# EAGLE design LAMPS (EAGLE 6.3)
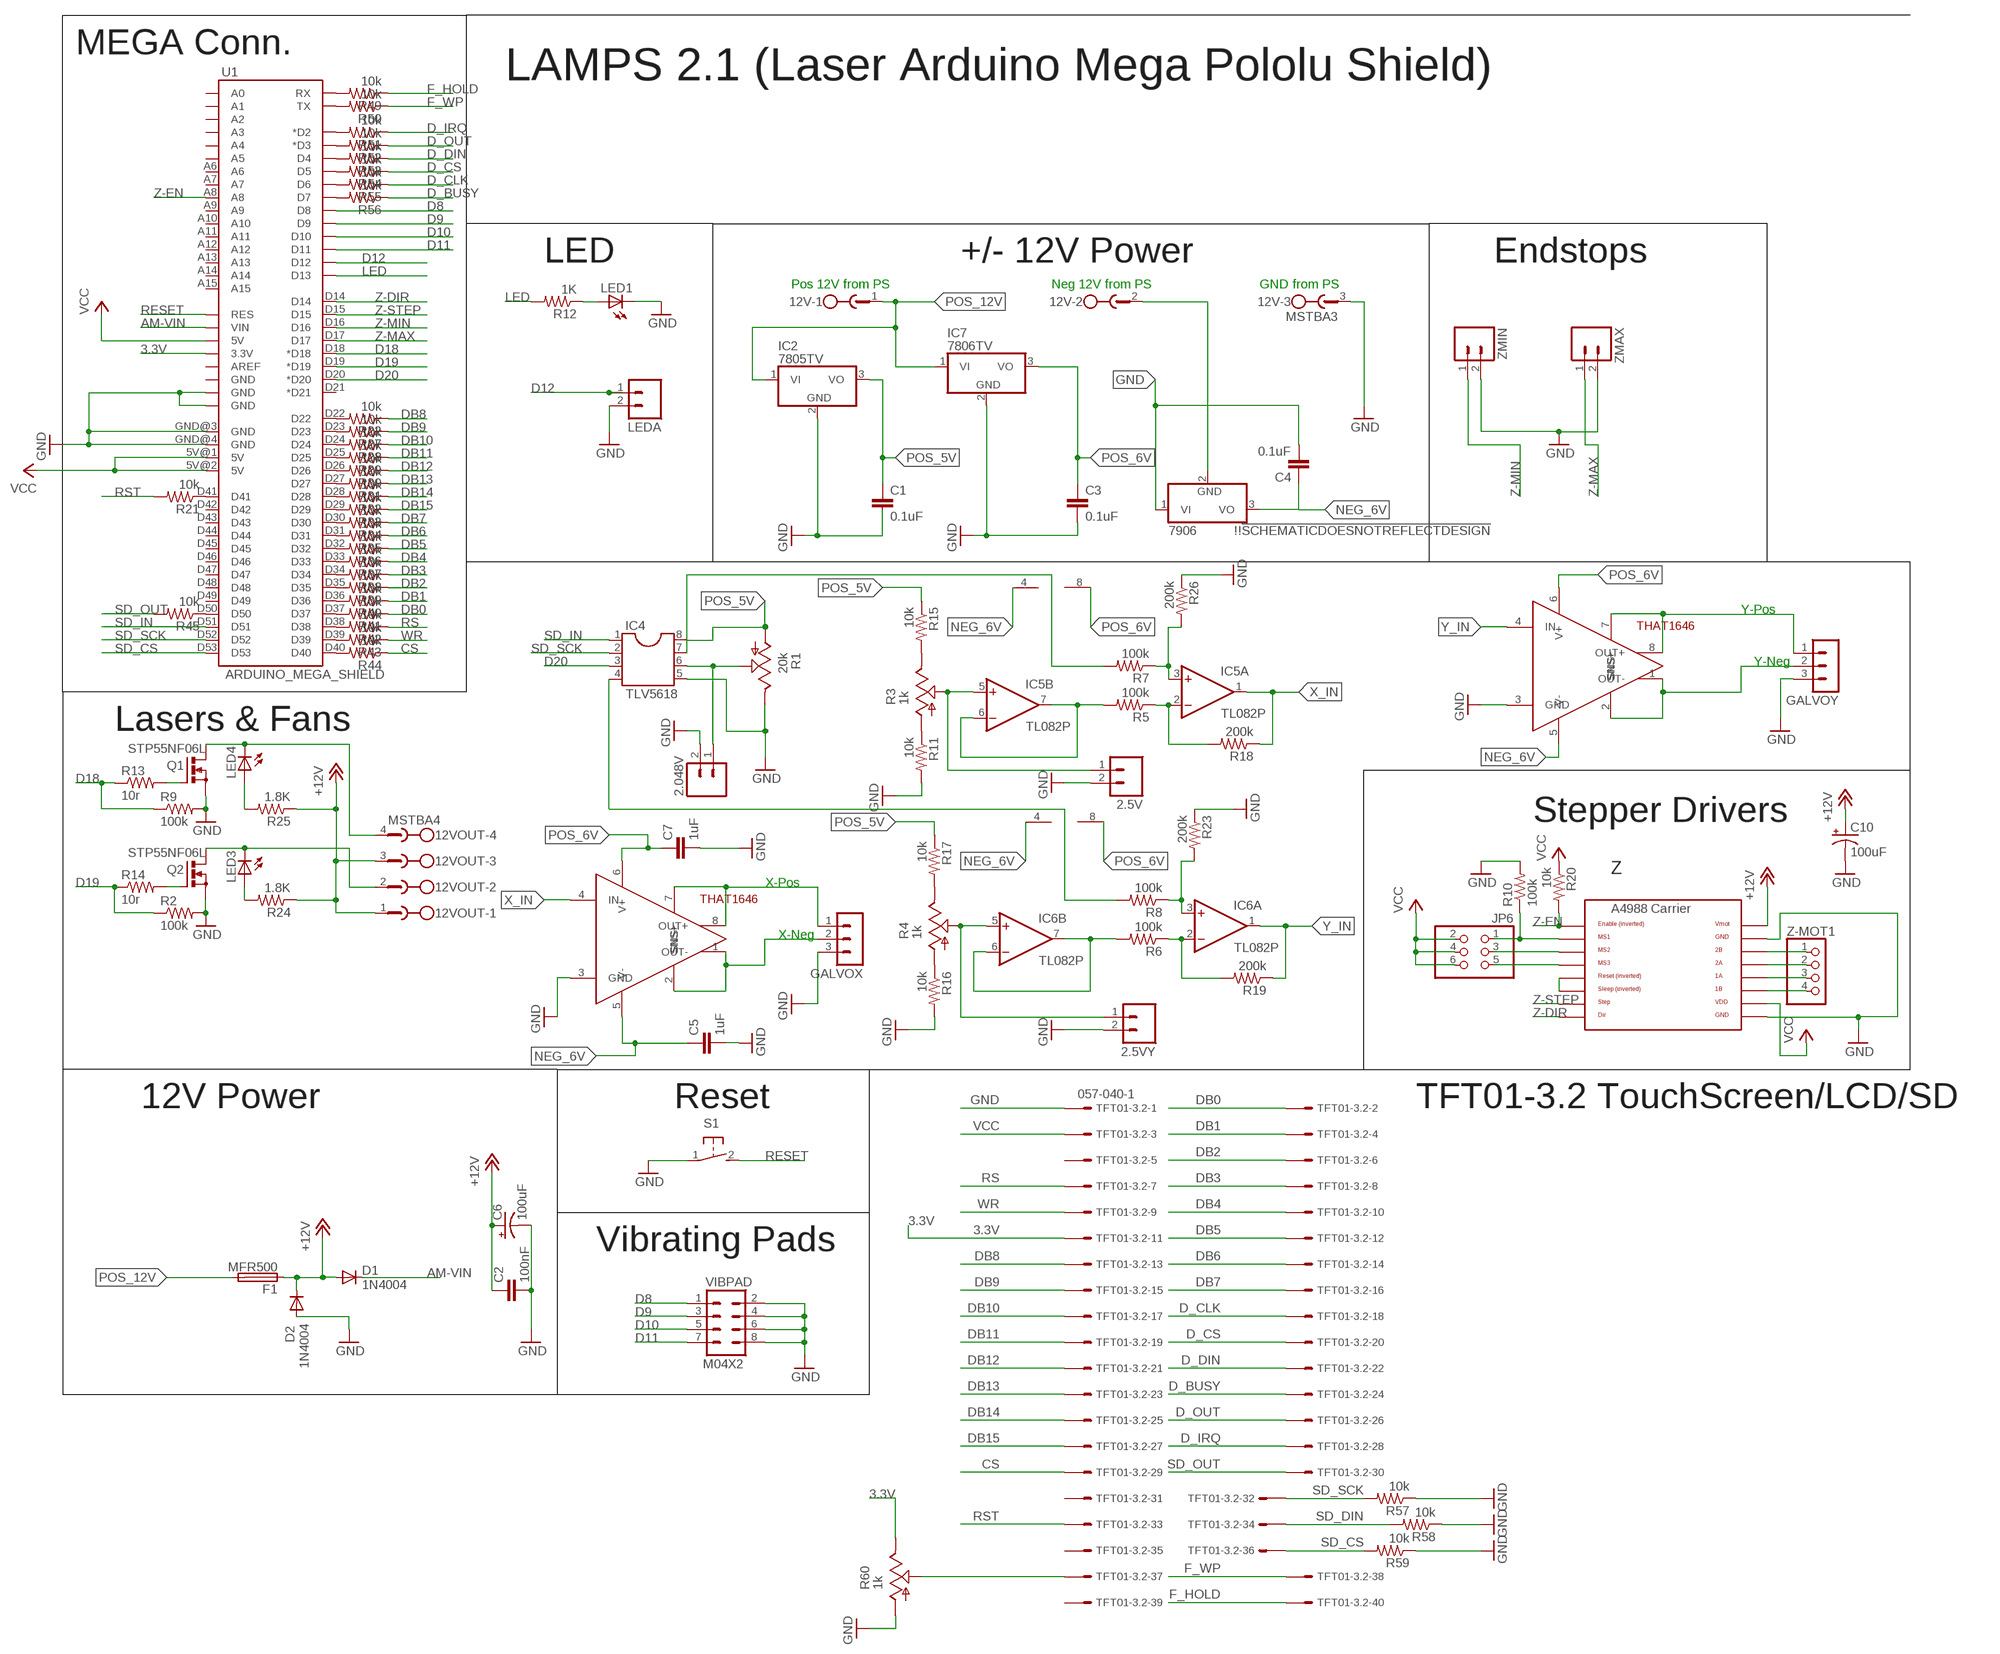
[diagram p0: schematic, sheet 1]

## Parts
2.5V  M02PTH  [1X02]
2.5VY  M02PTH  [1X02]
2.048V  M02PTH  [1X02]
12V  MSTBA3  [MSTBA3]
12VOUT  MSTBA4  [MSTBA4]
!!!SCHEMATICDOESNOTREFLECTDESIGN  7906  7805TV  [TO220V]
C1  0.1uF  C2.5/2  [C2.5-2]
C2  100nF  C-EUC0805  [C0805]
C3  0.1uF  C2.5/2  [C2.5-2]
C4  0.1uF  C2.5/2  [C2.5-2]
C5  1uF  C2.5/2  [C2.5-2]
C6  100uF  CPOL-US153CLV-0605  [153CLV-0605]
C7  1uF  C2.5/2  [C2.5-2]
C10  100uF  CPOL-US153CLV-0605  [153CLV-0605]
D1  1N4004  [DO41-10]
D2  1N4004  [DO41-10]
F1  MFR500  PTCFUSE  [MFR500]
GALVOX  3PIN-HEADER  [3PIN-HEADER]
GALVOY  3PIN-HEADER  [3PIN-HEADER]
IC2  7805TV  [TO220V]
IC4  TLV5618  DIL8S  [SOCKET-08]
IC5  TL082P  [DIL08]
IC6  TL082P  [DIL08]
IC7  7806TV  7805TV  [TO220V]
JP6  PINHD-2X3  [2X03]
LED1  LEDCHIP-LED0805  [CHIP-LED0805]
LED3  LEDCHIP-LED0805  [CHIP-LED0805]
LED4  LEDCHIP-LED0805  [CHIP-LED0805]
LEDA  M02PTH  [1X02]
Q1  STP55NF06L  IRF512  [TO220BV]
Q2  STP55NF06L  IRF512  [TO220BV]
R1  20k  TRIM_US-B25P  [B25P]
R2  100k  R-US_R0805  [R0805]
R3  1k  TRIM_US-B25P  [B25P]
R4  1k  TRIM_US-B25P  [B25P]
R5  100k  R-US_R0805  [R0805]
R6  100k  R-US_R0805  [R0805]
R7  100k  R-US_R0805  [R0805]
R8  100k  R-US_R0805  [R0805]
R9  100k  R-US_R0805  [R0805]
R10  100k  R-US_R0805  [R0805]
R11  10k  R-US_R0805  [R0805]
R12  1K  R-US_R0805  [R0805]
R13  10r  R-US_R0805  [R0805]
R14  10r  R-US_M0805  [M0805]
R15  10k  R-US_R0805  [R0805]
R16  10k  R-US_R0805  [R0805]
R17  10k  R-US_R0805  [R0805]
R18  200k  R-US_R0805  [R0805]
R19  200k  R-US_R0805  [R0805]
R20  10k  R-US_R0805  [R0805]
R21  10k  R-US_R0805  [R0805]
R22  10k  R-US_R0805  [R0805]
R23  200k  R-US_R0805  [R0805]
R24  1.8K  R-US_R0805  [R0805]
R25  1.8K  R-US_R0805  [R0805]
R26  200k  R-US_R0805  [R0805]
R27  10k  R-US_R0805  [R0805]
R28  10k  R-US_R0805  [R0805]
R29  10k  R-US_R0805  [R0805]
R30  10k  R-US_R0805  [R0805]
R31  10k  R-US_R0805  [R0805]
R32  10k  R-US_R0805  [R0805]
R33  10k  R-US_R0805  [R0805]
R34  10k  R-US_R0805  [R0805]
R35  10k  R-US_R0805  [R0805]
R36  10k  R-US_R0805  [R0805]
R37  10k  R-US_R0805  [R0805]
R38  10k  R-US_R0805  [R0805]
R39  10k  R-US_R0805  [R0805]
R40  10k  R-US_R0805  [R0805]
R41  10k  R-US_R0805  [R0805]
R42  10k  R-US_R0805  [R0805]
R43  10k  R-US_R0805  [R0805]
R44  10k  R-US_R0805  [R0805]
R45  10k  R-US_R0805  [R0805]
R49  10k  R-US_R0805  [R0805]
R50  10k  R-US_R0805  [R0805]
R51  10k  R-US_R0805  [R0805]
R52  10k  R-US_R0805  [R0805]
R53  10k  R-US_R0805  [R0805]
R54  10k  R-US_R0805  [R0805]
R55  10k  R-US_R0805  [R0805]
R56  10k  R-US_R0805  [R0805]
R57  10k  R-US_R0805  [R0805]
R58  10k  R-US_R0805  [R0805]
R59  10k  R-US_R0805  [R0805]
R60  1k  TRIM_US-B25P  [B25P]
S1  31-XX  [B3F-31XX]
TFT01-3.2  057-040-1  [057-040-1]
U1  ARDUINO_MEGA_SHIELD  [ARDUINO_MEGA_SHIELD]
U$1  THAT1646  [THAT1646]
U$4  THAT1646  [THAT1646]
U$8  A4988BREAKOUT  [A4988BREAKOUT]
VIBPAD  M04X2  [2X4]
Z-MOT1  PINHD-1X4  [1X04]
ZMAX  M02PTH  [1X02]
ZMIN  M02PTH  [1X02]

## Nets
3.3V: R60.E TFT01-3.2.11 U1.3.3V
+12V [power]: 12VOUT.1 12VOUT.3 C2.1 C6.+ C10.+ D1.A D2.C F1.1 R24.1 R25.1 U$8.VMOT
AM-VIN [power]: D1.C U1.VIN
CS: R44.1 TFT01-3.2.29
D8: U1.D8 VIBPAD.1
D9: U1.D9 VIBPAD.3
D10: U1.D10 VIBPAD.5
D11: U1.D11 VIBPAD.7
D12: LEDA.1 U1.D12
D18: R9.1 R13.1 U1.D18(*D18)
D19: R2.1 R14.1 U1.D19(*D19)
D20: IC4.3 U1.D20(*D20)
D_BUSY: R56.1 TFT01-3.2.24
D_CLK: R55.1 TFT01-3.2.18
D_CS: R54.1 TFT01-3.2.20
D_DIN: R53.1 TFT01-3.2.22
D_IRQ: R51.1 TFT01-3.2.28
D_OUT: R52.1 TFT01-3.2.26
DB0: R41.1 TFT01-3.2.2
DB1: R40.1 TFT01-3.2.4
DB2: R39.1 TFT01-3.2.6
DB3: R38.1 TFT01-3.2.8
DB4: R37.1 TFT01-3.2.10
DB5: R36.1 TFT01-3.2.12
DB6: R35.1 TFT01-3.2.14
DB7: R34.1 TFT01-3.2.16
DB8: R22.1 TFT01-3.2.13
DB9: R27.1 TFT01-3.2.15
DB10: R28.1 TFT01-3.2.17
DB11: R29.1 TFT01-3.2.19
DB12: R30.1 TFT01-3.2.21
DB13: R31.1 TFT01-3.2.23
DB14: R32.1 TFT01-3.2.25
DB15: R33.1 TFT01-3.2.27
F_HOLD: R49.1 TFT01-3.2.40
F_WP: R50.1 TFT01-3.2.38
GND: 2.5V.2 2.5VY.2 2.048V.2 12V.3 !!!SCHEMATICDOESNOTREFLECTDESIGN.1(VI) C1.2 C2.2 C3.2 C4.2 C5.2 C6.- C7.2 C10.- GALVOX.3 GALVOY.3 IC2.2(GND) IC4.5 IC7.2(GND) LED1.C LEDA.2 Q1.S Q2.S R1.E R2.2 R9.2 R10.2 R11.2 R16.2 R23.1 R26.1 R57.1 R58.1 R59.1 R60.A S1.1(P) TFT01-3.2.1 U1.GND@0(GND) U1.GND@1(GND) U1.GND@3(GND) U1.GND@4(GND) U$1.3(GND) U$4.3(GND) U$8.GND U$8.GND@0(GND) VIBPAD.2 VIBPAD.4 VIBPAD.6 VIBPAD.8 ZMAX.2 ZMIN.2
GND_0: D2.A ; supply symbol labelled GND
LED: R12.2 U1.D13
N$1: 12VOUT.2 LED3.C Q2.D
N$2: R21.1 U1.D41
N$3 [power]: 12V.2 !!!SCHEMATICDOESNOTREFLECTDESIGN.2(GND)
N$4: R4.A R16.1
N$5: R4.E R17.2
N$6: 2.048V.1 IC4.6 R1.S
N$7: 12VOUT.4 LED4.C Q1.D
N$8: R3.A R11.1
N$9: R3.E R15.2
N$10: 2.5VY.1 IC6.5(B:+IN) R4.S
N$11: 2.5V.1 IC5.5(B:+IN) R3.S
N$12: GALVOX.2 U$1.1(OUT-) U$1.2(SNS-)
N$13: GALVOX.1 U$1.7(SNS+) U$1.8(OUT+)
N$14: IC5.6(B:-IN) IC5.7(B:OUT) R5.2
N$15: IC5.2(A:-IN) R5.1 R18.2
N$16: IC4.7 R7.2
N$17: IC5.3(A:+IN) R7.1 R26.2
N$18: IC6.6(B:-IN) IC6.7(B:OUT) R6.2
N$19: R22.2 U1.D22
N$20: IC6.2(A:-IN) R6.1 R19.2
N$21: IC4.4 R8.2
N$22: IC6.3(A:+IN) R8.1 R23.2
N$23: R27.2 U1.D23
N$24: GALVOY.2 U$4.1(OUT-) U$4.2(SNS-)
N$25: GALVOY.1 U$4.7(SNS+) U$4.8(OUT+)
N$26: R28.2 U1.D24
N$27: R29.2 U1.D25
N$28: R30.2 U1.D26
N$29: R31.2 U1.D27
N$30: R32.2 U1.D28
N$31: R33.2 U1.D29
N$32: R34.2 U1.D30
N$33: R35.2 U1.D31
N$34: R36.2 U1.D32
N$35: R37.2 U1.D33
N$36: R38.2 U1.D34
N$37: JP6.3 U$8.MS2
N$38: U$8.RST U$8.SLP(SLEEP)
N$39: JP6.5 U$8.MS3
N$40: JP6.1 R10.1 U$8.MS1
N$41: U$8.2B Z-MOT1.1
N$42: U$8.2A Z-MOT1.2
N$43: U$8.1A Z-MOT1.3
N$44: U$8.1B Z-MOT1.4
N$45: LED3.A R24.2
N$46: LED1.A R12.1
N$47: Q2.G R14.2
N$48: Q1.G R13.2
N$49: R39.2 U1.D35
N$50: LED4.A R25.2
N$51: R40.2 U1.D36
N$52: R41.2 U1.D37
N$53: R42.2 U1.D38
N$54: R43.2 U1.D39
N$55: R44.2 U1.D40
N$56: R45.1 U1.D50
N$60: R49.2 U1.RX
N$61: R50.2 U1.TX
N$62: R51.2 U1.D2(*D2)
N$63: R52.2 U1.D3(*D3)
N$64: R53.2 U1.D4
N$65: R54.2 U1.D5
N$66: R55.2 U1.D6
N$67: R56.2 U1.D7
N$86: R60.S TFT01-3.2.37
NEG_6V: !!!SCHEMATICDOESNOTREFLECTDESIGN.3(VO) C4.1 C5.1 IC5.4(P:V-) IC6.4(P:V-) U$1.5(V-)
POS_5V: C1.1 IC2.3(VO) IC4.8 R1.A R15.1 R17.1
POS_6V: C3.1 C7.1 IC5.8(P:V+) IC6.8(P:V+) IC7.3(VO) U$1.6(V+) U$4.6(V+)
POS_12V [power]: 12V.1 F1.2 IC2.1(VI) IC7.1(VI)
RESET: S1.2(S) U1.RES
RS: R42.1 TFT01-3.2.7
RST: R21.2 TFT01-3.2.33
SD_CS: R59.2 TFT01-3.2.36 U1.D53
SD_DIN: R58.2 TFT01-3.2.34
SD_IN: IC4.1 U1.D51
SD_OUT: R45.2 TFT01-3.2.30
SD_SCK: IC4.2 R57.2 TFT01-3.2.32 U1.D52
T2_5: U$4.5(V-)
VCC: JP6.2 JP6.4 JP6.6 R20.1 TFT01-3.2.3 U1.5V@0(5V) U1.5V@1(5V) U1.5V@2(5V) U$8.VDD
WR: R43.1 TFT01-3.2.9
X_IN: IC5.1(A:OUT) R18.1 U$1.4(IN)
Y_IN: IC6.1(A:OUT) R19.1 U$4.4(IN)
Z-DIR: U1.D14 U$8.DIR
Z-EN: R20.2 U1.A8 U$8.EN
Z-MAX: U1.D17 ZMAX.1
Z-MIN: U1.D16 ZMIN.1
Z-STEP: U1.D15 U$8.STEP
Unconnected: TFT01-3.2.5 TFT01-3.2.31 TFT01-3.2.35 TFT01-3.2.39 U1.A0 U1.A1 U1.A2 U1.A3 U1.A4 U1.A5 U1.A6 U1.A7 U1.A9 U1.A10 U1.A11 U1.A12 U1.A13 U1.A14 U1.A15 U1.AREF U1.D21(*D21) U1.D42 U1.D43 U1.D44 U1.D45 U1.D46 U1.D47 U1.D48 U1.D49 U1.GND@2(GND)

## Notes on the sheet
- MEGA Conn.
- LAMPS 2.1 (Laser Arduino Mega Pololu Shield)
- LED | +/- 12V Power | Endstops
- Pos 12V from PS | Neg 12V from PS | GND from PS
- Y-Pos
- Y-Neg
- Lasers & Fans
- Stepper Drivers
- Z
- X-Pos
- X-Neg
- 12V Power | Reset | TFT01-3.2 TouchScreen/LCD/SD
- Vibrating Pads

## Library data of the parts
2.5V 2.5VY 2.048V LEDA ZMAX ZMIN = SparkFun:M02: Header 2 Standard 2-pin 0.1" header. Use with straight break away headers (SKU : PRT-00116), right angle break away headers (PRT-00553), swiss pins (PRT-00743), machine pins (PRT-00117), and female headers (PRT-00115). Molex polarized connector foot print use with SKU : PRT-08233 with associated crimp pins and housings.; OC_NEWARK: unknown
12V = con-phoenix-508:MSTBA3: PHOENIX; MF: FARNELL; MPN: 1757255; OC_FARNELL: 3705183; OC_NEWARK: 71C4162
12VOUT = con-phoenix-508:MSTBA4: PHOENIX; OC_FARNELL: 3705195; OC_NEWARK: unknown
!!!SCHEMATICDOESNOTREFLECTDESIGN = linear:78*: Positive VOLTAGE REGULATOR Source: http://cache.national.com/ds/LM/LM78L05.pdf http://www.fairchildsemi.com/ds/LM/LM7805.pdf; MPN: KA7906TU; OC_NEWARK: 94M7930
C1 C3-C5 C7 = capacitor-wima:C: CAPACITOR naming: grid - package width; OC_NEWARK: unknown
C2 = resistor:C-EU: CAPACITOR, European symbol; OC_NEWARK: unknown
C6 C10 = adafruit:CPOL-US: POLARIZED CAPACITOR, American symbol; OC_NEWARK: unknown
D1 D2 = diode:1N4004: DIODE general purpose rectifier, 1 A; OC_NEWARK: unknown
F1 = RepRapjr:PTCFUSE: LITTLEFUSE Picofuse/slow Littlefuse; OC_NEWARK: unknown
GALVOX GALVOY = ultimachine:3PIN-HEADER: PIN HEADER; OC_NEWARK: unknown
IC2 IC7 = linear:78*: Positive VOLTAGE REGULATOR Source: http://cache.national.com/ds/LM/LM78L05.pdf http://www.fairchildsemi.com/ds/LM/LM7805.pdf; OC_NEWARK: unknown
IC4 = ic-package:DIL8: Dual In Line / Socket; MF: TEXAS INSTRUMENT CONNECTORS; MPN: TLV5618AIP; OC_NEWARK: 76C8920
IC5 IC6 = linear:TL082: OP AMP; OC_NEWARK: unknown
JP6 = pinhead:PINHD-2X3: PIN HEADER; OC_NEWARK: unknown
LED1 LED3 LED4 = led:LED: LED OSRAM: - CHIPLED LG R971, LG N971, LY N971, LG Q971, LY Q971, LO R971, LY R971 LH N974, LH R974 LS Q976, LO Q976, LY Q976 LO Q996 - Hyper CHIPLED LW Q18S LB Q993, LB Q99A, LB R99A - SideLED LS A670, LO A670, LY A670, LG A670, LP A670 LB A673, LV A673, LT A673, LW A673 LH A674 LY A675 LS A676, LA A676, LO A676, LY A676, LW A676 LS A679, LY A679, LG A679 - Hyper Micro SIDELED� LS Y876, LA Y876, LO Y876, LY Y876 LT Y87S - SmartLED LW L88C, LW L88S LB L89C, LB L89S, LG L890 LS L89K, LO L89K, LY L89K LS L896, LA L896, LO L896, LY L896 - TOPLED LS T670, LO T670, LY T670, LG T670, LP T670 LSG T670, LSP T670, LSY T670, LOP T670, LYG T670 LG T671, LOG T671, LSG T671 LB T673, LV T673, LT T673, LW T673 LH T674 LS T676, LA T676, LO T676, LY T676, LB T676, LH T676, LSB T676, LW T676 LB T67C, LV T67C, LT T67C, LS T67K, LO T67K, LY T67K, LW E67C LS E67B, LA E67B, LO E67B, LY E67B, LB E67C, LV E67C, LT E67C LW T67C LS T679, LY T679, LG T679 LS T770, LO T770, LY T770, LG T770, LP T770 LB T773, LV T773, LT T773, LW T773 LH T774 LS E675, LA E675, LY E675, LS T675 LS T776, LA T776, LO T776, LY T776, LB T776 LHGB T686 LT T68C, LB T68C - Hyper Mini TOPLED� LB M676 - Mini TOPLED Santana� LG M470 LS M47K, LO M47K, LY M47K Source: http://www.osram.convergy.de LUXEON: - LUMILED� LXK2-PW12-R00, LXK2-PW12-S00, LXK2-PW14-U00, LXK2-PW14-V00 LXK2-PM12-R00, LXK2-PM12-S00, LXK2-PM14-U00 LXK2-PE12-Q00, LXK2-PE12-R00, LXK2-PE12-S00, LXK2-PE14-T00, LXK2-PE14-U00 LXK2-PB12-K00, LXK2-PB12-L00, LXK2-PB12-M00, LXK2-PB14-N00, LXK2-PB14-P00, LXK2-PB14-Q00 LXK2-PR12-L00, LXK2-PR12-M00, LXK2-PR14-Q00, LXK2-PR14-R00 LXK2-PD12-Q00, LXK2-PD12-R00, LXK2-PD12-S00 LXK2-PH12-R00, LXK2-PH12-S00 LXK2-PL12-P00, LXK2-PL12-Q00, LXK2-PL12-R00 Source: www.luxeon.com KINGBRIGHT: KA-3528ASYC Source: www.kingbright.com; OC_NEWARK: unknown
Q1 Q2 = transistor-power:IRF512: N-CHANNEL MOS FET; MF: INTERNATIONAL RECTIFIER(IR); MPN: IRF1010EZPBF; OC_NEWARK: 63J7168
R1 R3 R4 R60 = pot:TRIM_US-: POTENTIOMETER; OC_NEWARK: unknown
R2 R5-R12 R15-R45 R49-R59 = adafruit:R-US_: RESISTOR, American symbol; OC_NEWARK: unknown
R13 R14 = resistor:R-US_: RESISTOR, American symbol; OC_NEWARK: unknown
S1 = switch-omron:31-XX: OMRON SWITCH; OC_FARNELL: 959704; OC_NEWARK: unknown
TFT01-3.2 = con-panduit:057-040-: CONNECTOR 40-pin series 057 contact pc board low profile headers; OC_FARNELL: unknown; OC_NEWARK: unknown
U1 = RepRapjr:ARDUINO_MEGA_SHIELD; OC_NEWARK: unknown
U$1 U$4 = THAT1646:THAT1646: THAT 1646 Balanced Line Driver (DIP) Datasheet: http://www.thatcorp.com/datashts/THAT_1606-1646_Datasheet.pdf; MPN: THAT1646P08-U; OC_NEWARK: 50M5186
U$8 = RepRapjr:A4988BREAKOUT; OC_NEWARK: unknown
VIBPAD = SparkFun:M04X2; OC_NEWARK: unknown
Z-MOT1 = RepRapjr:PINHD-1X4: PIN HEADER; OC_NEWARK: unknown

## Net classes
1 power: width 1.016 mm

## Board
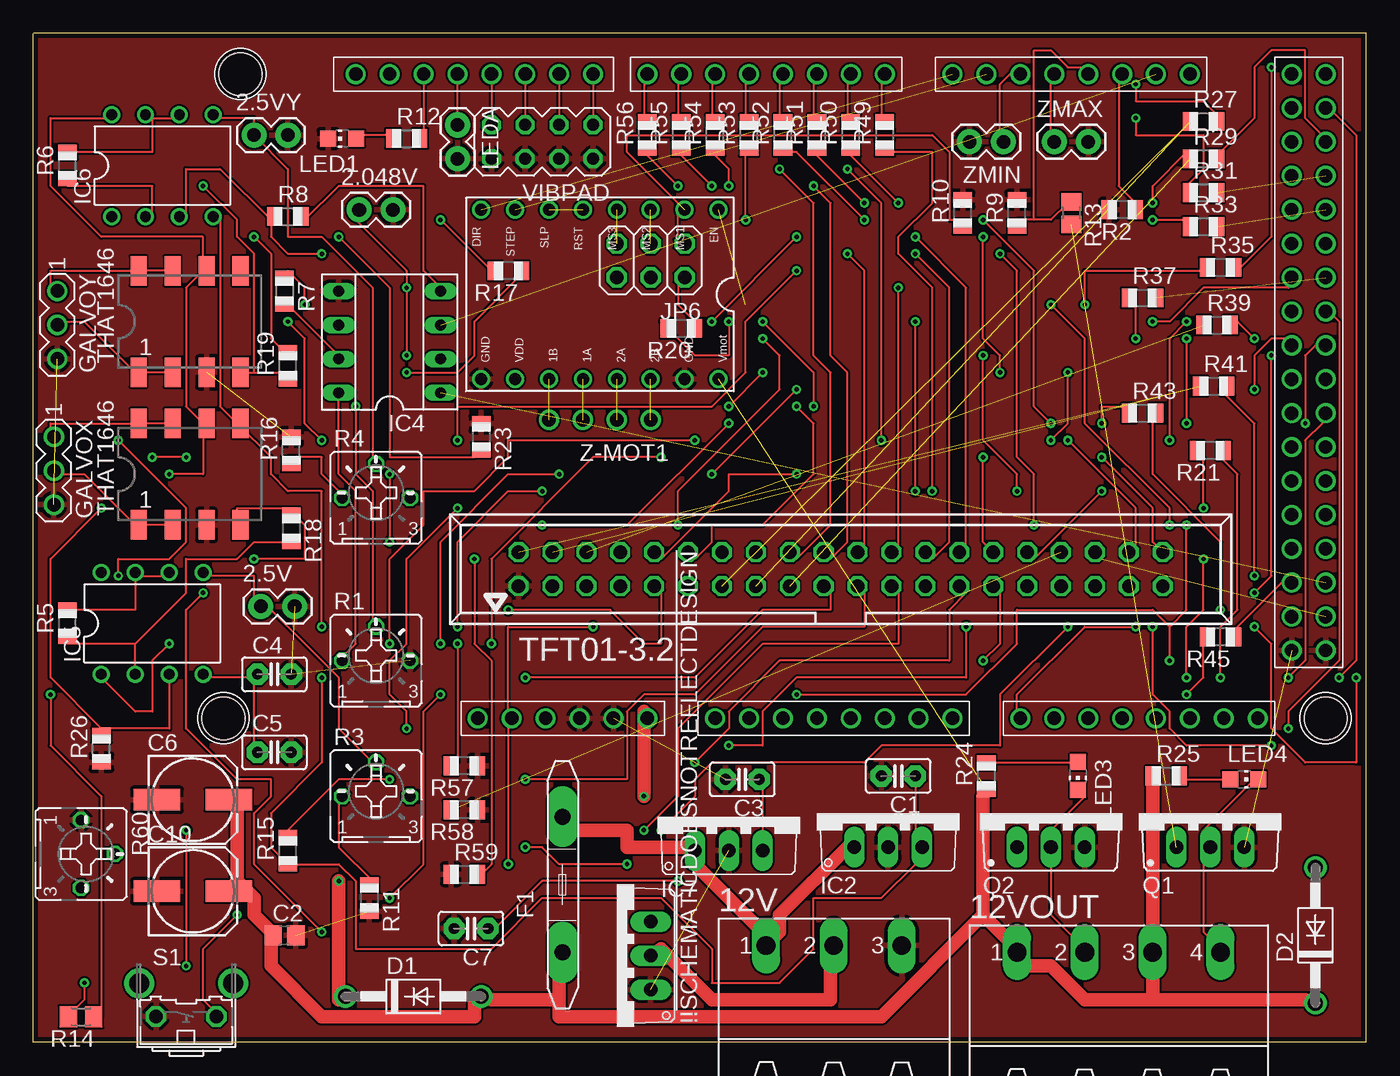
[diagram p1: board, top side]
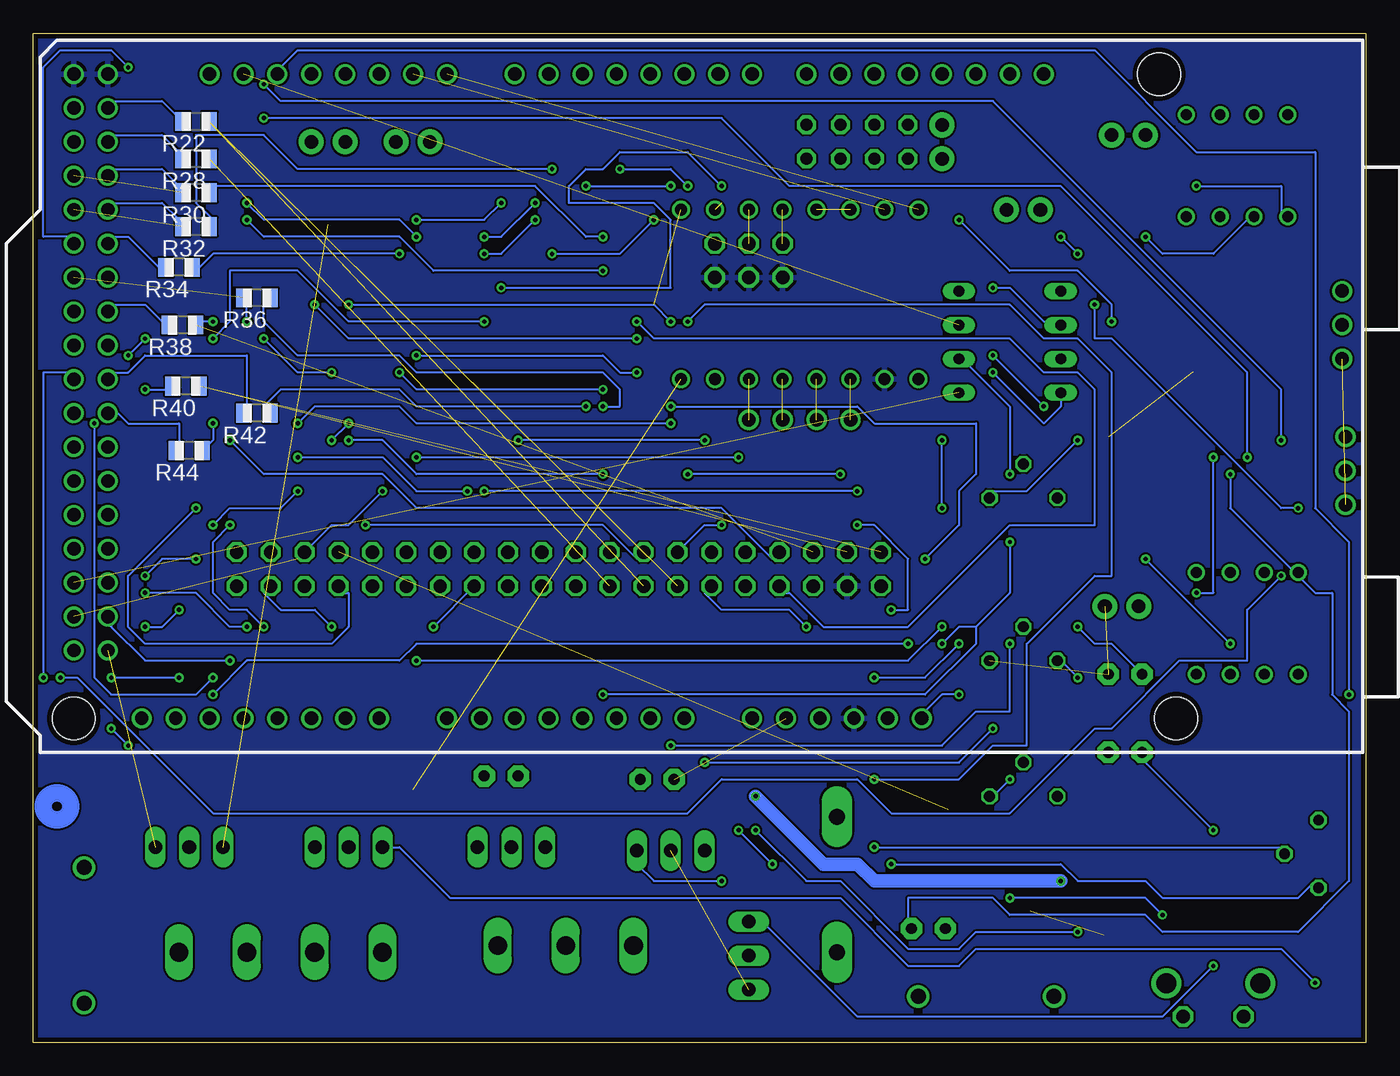
[diagram p2: board, bottom side, seen from below]

Size 99.82 x 75.56 mm. Coordinates in mm from the lower left corner, seen from the top.
Outline: 99.82,75.56 99.82,0 0,0 0,75.56
Outline: 99.82,75.56 0.01,75.56
Copper layers (1*16): Top 0.0356mm / dielectric 1.5011mm / Bottom 0.0356mm
Design rules "LaenPCBOrder": minimum track width 6mil, minimum drill 13mil, track to track 6mil, track to pad 6mil, pad to pad 6mil, via to via 6mil, smd to smd 6mil, copper to edge 15mil, drill to drill 6mil, minimum pad ring 7mil, minimum via ring 7mil, stop-mask expansion 4mil, vias tented up to drill 0mil, thermal gap 10mil

### Footprints (pad centres in the part's own frame; a part is rotated, then mirrored left to right if it is on the bottom)
1X02 = drill 1.016 pad 1.88: 1 0,0; 2 2.54,0
MSTBA3 = drill 1.397 long: 1 -5.08,5.08; 2 0,5.08; 3 5.08,5.08
MSTBA4 = drill 1.397 long: 1 -7.62,5.08; 2 -2.54,5.08; 3 2.54,5.08; 4 7.62,5.08
TO220V = drill 1.016 long: 1 -2.54,-2.54; 2 0,-2.54; 3 2.54,-2.54
C2.5-2 = drill 0.813 pad 1.6 octagon: 1 -1.27,0; 2 1.27,0
C0805 = smd 1.3 x 1.5: 1 -0.85,0; 2 0.85,0
153CLV-0605 = smd 3.5 x 1.6: + 2.7,0; - -2.7,0
DO41-10 = drill 1.118: A 5.08,0; C -5.08,0
MFR500 = drill 1.2 pad 2.3 long: 1 -5.08,0; 2 5.08,0
3PIN-HEADER = drill 1.016: 1 -2.54,0; 2 0,0; 3 2.54,0
SOCKET-08 = drill 0.813 long: 1 -3.81,-3.81; 2 -1.27,-3.81; 3 1.27,-3.81; 4 3.81,-3.81; 5 3.81,3.81; 6 1.27,3.81; 7 -1.27,3.81; 8 -3.81,3.81
DIL08 = drill 0.813 pad 1.27: 1 -3.81,-3.81; 2 -1.27,-3.81; 3 1.27,-3.81; 4 3.81,-3.81; 5 3.81,3.81; 6 1.27,3.81; 7 -1.27,3.81; 8 -3.81,3.81
2X03 = drill 1.016 octagon: 1 -2.54,-1.27; 2 -2.54,1.27; 3 0,-1.27; 4 0,1.27; 5 2.54,-1.27; 6 2.54,1.27
CHIP-LED0805 = smd 1.2 x 1.2: A 0,-1.05; C 0,1.05
TO220BV = drill 1.016 long: D 0,-2.54; G -2.54,-2.54; S 2.54,-2.54
B25P = drill 0.813 octagon: A -2.54,0; E 2.54,0; S 0,2.54
R0805 = smd 1.1 x 1.4: 1 -1,0; 2 1,0
R0805' = smd 1.3 x 1.5: 1 -0.85,0; 2 0.85,0
M0805 = smd 1.3 x 1.6: 1 -0.95,0; 2 0.95,0
B3F-31XX = drill 1.016 octagon: 1 -2.261,-1.245; 2 2.261,-1.245 | drill 1.499 pad 2.159: 3 -3.505,1.245; 4 3.505,1.245
057-040-1 = drill 1 octagon: 1 -24.13,-1.27; 2 -24.13,1.27; 3 -21.59,-1.27; 4 -21.59,1.27; 5 -19.05,-1.27; 6 -19.05,1.27; 7 -16.51,-1.27; 8 -16.51,1.27; 9 -13.97,-1.27; 10 -13.97,1.27; 11 -11.43,-1.27; 12 -11.43,1.27; 13 -8.89,-1.27; 14 -8.89,1.27; 15 -6.35,-1.27; 16 -6.35,1.27; 17 -3.81,-1.27; 18 -3.81,1.27; 19 -1.27,-1.27; 20 -1.27,1.27; 21 1.27,-1.27; 22 1.27,1.27; 23 3.81,-1.27; 24 3.81,1.27; 25 6.35,-1.27; 26 6.35,1.27; 27 8.89,-1.27; 28 8.89,1.27; 29 11.43,-1.27; 30 11.43,1.27; 31 13.97,-1.27; 32 13.97,1.27; 33 16.51,-1.27; 34 16.51,1.27; 35 19.05,-1.27; 36 19.05,1.27; 37 21.59,-1.27; 38 21.59,1.27; 39 24.13,-1.27; 40 24.13,1.27
ARDUINO_MEGA_SHIELD = drill 1 pad 1.422: 3.3V 35.56,2.54; 5V@0 38.1,2.54; 5V@1 93.98,50.8; 5V@2 96.52,50.8; A0 50.8,2.54; A1 53.34,2.54; A2 55.88,2.54; A3 58.42,2.54; A4 60.96,2.54; A5 63.5,2.54; A6 66.04,2.54; A7 68.58,2.54; A8 73.66,2.54; A9 76.2,2.54; A10 78.74,2.54; A11 81.28,2.54; A12 83.82,2.54; A13 86.36,2.54; A14 88.9,2.54; A15 91.44,2.54; AREF 23.876,50.8; D2 58.42,50.8; D3 55.88,50.8; D4 53.34,50.8; D5 50.8,50.8; D6 48.26,50.8; D7 45.72,50.8; D8 41.656,50.8; D9 39.116,50.8; D10 36.576,50.8; D11 34.036,50.8; D12 31.496,50.8; D13 28.956,50.8; D14 68.58,50.8; D15 71.12,50.8; D16 73.66,50.8; D17 76.2,50.8; D18 78.74,50.8; D19 81.28,50.8; D20 83.82,50.8; D21 86.36,50.8; D22 93.98,48.26; D23 96.52,48.26; D24 93.98,45.72; D25 96.52,45.72; D26 93.98,43.18; D27 96.52,43.18; D28 93.98,40.64; D29 96.52,40.64; D30 93.98,38.1; D31 96.52,38.1; D32 93.98,35.56; D33 96.52,35.56; D34 93.98,33.02; D35 96.52,33.02; D36 93.98,30.48; D37 96.52,30.48; D38 93.98,27.94; D39 96.52,27.94; D40 93.98,25.4; D41 96.52,25.4; D42 93.98,22.86; D43 96.52,22.86; D44 93.98,20.32; D45 96.52,20.32; D46 93.98,17.78; D47 96.52,17.78; D48 93.98,15.24; D49 96.52,15.24; D50 93.98,12.7; D51 96.52,12.7; D52 93.98,10.16; D53 96.52,10.16; GND@0 40.64,2.54; GND@1 43.18,2.54; GND@2 26.416,50.8; GND@3 93.98,7.62; GND@4 96.52,7.62; RES 33.02,2.54; RX 63.5,50.8; TX 60.96,50.8; VIN 45.72,2.54 | hole 3.2: 96.52,2.54; 13.97,2.54; 15.24,50.8
THAT1646 = smd 1.2 x 2.2: 1 -3.81,-3.8; 2 -1.27,-3.8; 3 1.27,-3.8; 4 3.81,-3.8; 5 3.81,3.8; 6 1.27,3.8; 7 -1.27,3.8; 8 -3.81,3.8
A4988BREAKOUT = drill 0.9: 1A 8.89,1.27; 1B 11.43,1.27; 2A 6.35,1.27; 2B 3.81,1.27; DIR 16.51,-11.43; EN -1.27,-11.43; GND 16.51,1.27; GND@0 1.27,1.27; MS1 1.27,-11.43; MS2 3.81,-11.43; MS3 6.35,-11.43; RST 8.89,-11.43; SLP 11.43,-11.43; STEP 13.97,-11.43; VDD 13.97,1.27; VMOT -1.27,1.27
2X4 = drill 0.9 pad 1.422 octagon: 1 -3.81,-1.27; 2 -3.81,1.27; 3 -1.27,-1.27; 4 -1.27,1.27; 5 1.27,-1.27; 6 1.27,1.27; 7 3.81,-1.27; 8 3.81,1.27
1X04 = drill 1.016: 1 -2.54,0; 2 0,0; 3 2.54,0; 4 5.08,0

### Placement (x,y rotation side)
2.5V  17.03,32.64 0 top
2.5VY  16.52,67.95 0 top
2.048V  24.4,62.36 0 top
12V  59.96,2.16 0 top
12VOUT  81.29,1.65 0 top
!!!SCHEMATICDOESNOTREFLECTDESIGN  43.7,6.48 90 top
C1  64.78,19.94 180 top
C2  18.81,8 0 top
C3  53.1,19.69 180 top
C4  18.05,27.56 0 top
C5  18.05,21.72 0 top
C6  11.95,18.16 0 top
C7  32.78,8.51 180 top
C10  11.95,11.3 0 top
D1  28.46,3.43 0 top
D2  96.02,8 90 top
F1  39.64,11.81 90 top
GALVOX  1.54,42.8 270 top
GALVOY  1.79,53.72 270 top
IC2  64.02,17.14 0 top
IC4  26.68,52.45 90 top
IC5  8.9,31.37 0 top
IC6  9.66,65.66 0 top
IC7  52.08,16.89 0 top
JP6  46.24,58.55 180 top
LED1  23.13,67.69 90 top
LED3  78.24,19.94 180 top
LED4  90.69,19.69 270 top
LEDA  31.76,68.71 270 top
Q1  88.15,17.14 0 top
Q2  76.21,17.14 0 top
R1  25.67,28.57 0 top
R2  81.55,62.36 180 top
R3  25.67,18.41 0 top
R4  25.67,40.77 0 top
R5  2.55,31.37 90 top
R6  2.55,65.66 90 top
R7  18.81,56.26 270 top
R8  19.06,61.85 0 top
R9  73.67,62.1 90 top
R10  69.61,62.1 90 top
R11  25.16,10.79 270 top
R12  27.95,67.69 0 top
R13  10r  [R0805']  77.74,62.1 270 top
R14  3.57,1.9 180 top
R15  19.06,14.35 90 top
R16  19.32,44.32 90 top
R17  35.57,57.79 180 top
R18  19.32,38.48 270 top
R19  19.06,50.67 90 top
R20  48.53,53.47 180 top
R21  88.15,44.32 180 top
R22  87.64,68.96 180 bottom
R23  33.54,45.34 270 top
R24  71.39,19.94 90 top
R25  84.85,19.94 0 top
R26  5.09,21.97 90 top
R27  87.64,68.96 0 top
R28  87.64,66.17 180 bottom
R29  87.64,66.17 0 top
R30  87.64,63.63 180 bottom
R31  87.64,63.63 0 top
R32  87.64,61.09 180 bottom
R33  87.64,61.09 0 top
R34  88.91,58.04 180 bottom
R35  88.91,58.04 0 top
R36  83.07,55.75 180 bottom
R37  83.07,55.75 0 top
R38  88.66,53.72 180 bottom
R39  88.66,53.72 0 top
R40  88.4,49.15 180 bottom
R41  88.4,49.15 0 top
R42  83.07,47.12 180 bottom
R43  83.07,47.12 0 top
R44  88.15,44.32 180 bottom
R45  88.91,30.35 180 top
R49  63.77,67.95 90 top
R50  61.23,67.95 90 top
R51  58.69,67.95 90 top
R52  56.15,67.95 90 top
R53  53.61,67.95 90 top
R54  51.07,67.95 90 top
R55  48.53,67.95 90 top
R56  45.99,67.95 90 top
R57  32.27,20.7 180 top
R58  32.27,17.4 180 top
R59  32.27,12.57 0 top
R60  3.57,14.1 270 top
S1  11.44,3.17 0 top
TFT01-3.2  60.46,35.43 0 top
U1  0.27,21.72 0 top
U$1  11.7,42.54 0 top
U$4  11.7,53.97 0 top
U$8  50.05,50.93 180 top
VIBPAD  38.11,67.44 180 top
Z-MOT1  43.7,46.61 180 top
ZMAX  76.47,67.44 0 top
ZMIN  72.66,67.44 180 top

### Tracks (layer width: path | path; a pad name or v marks a point on that pad's centre or on a via)
3.3V  (via drill 0.33)
  Top 0.152: 35.57,24.77 v35.57,13.33 | v41.92,31.11 35.57,31.11 35.57,24.77 | 35.57,24.77 U1.3.3V
  Bottom 0.152: v35.57,13.33 22.87,13.33 21.6,12.06 16.52,12.06 15.25,10.79 5.09,10.79 3.82,12.06 R60.E | v41.92,31.11 43.19,32.38 48.27,32.38 49.54,33.65 TFT01-3.2.11
+12V  (1 unrouted)
  Top 1.016: 71.13,9.53 71.13,18.41 R24.1 | 71.13,9.53 73.67,6.98 12VOUT.1 73.67,5.71 76.21,5.71 78.75,3.17 83.83,3.17 | R25.1 83.83,19.69 12VOUT.3 83.83,3.17 | 83.83,3.17 95.26,3.17 D2.C | 17.79,8.26 16.52,9.53 16.52,10.79 15.25,12.06 | 15.25,12.06 15.25,18.41 C6.+ | 15.25,12.06 C10.+ | 39.38,3.17 34.3,3.17 D1.A 33.03,3.17 33.03,1.9 21.6,1.9 17.79,5.71 17.79,8.26 | 39.38,3.17 39.38,5.71 F1.1 | 17.79,8.26 C2.1 | 71.13,9.53 63.51,1.9 39.38,1.9 39.38,3.17
AM-VIN  (via drill 0.33)
  Top 1.016: v45.73,18.41 45.73,24.77 U1.VIN | v22.87,12.06 22.87,3.17 D1.C
  Bottom 1.016: v45.73,18.41 40.65,13.33 38.11,13.33 36.84,12.06 v22.87,12.06
CS  (via drill 0.33)
  Top 0.152: v86.37,52.7 v86.37,46.35 | v66.05,41.27 v66.05,53.97 | v38.11,41.27 35.57,41.27 31.76,37.46 v31.76,31.11 | v71.13,28.57 72.4,29.84 72.4,33.65 TFT01-3.2.29
  Bottom 0.152: v86.37,46.35 86.37,45.09 87.64,43.81 R44.1 | v86.37,52.7 85.1,53.97 85.1,57.79 80.02,57.79 76.21,53.97 v66.05,53.97 | v38.11,41.27 v66.05,41.27 | v31.76,31.11 34.3,28.57 v71.13,28.57
D8
  Top 0.152: VIBPAD.1 U1.D8 41.92,73.03
D9
  Top 0.152: VIBPAD.3 U1.D9 39.38,73.03
D10
  Top 0.152: VIBPAD.5 U1.D10 36.84,73.03
D11
  Top 0.152: VIBPAD.7 U1.D11 34.3,73.03
D12
  Top 0.152: LEDA.1 U1.D12 31.76,73.03
D18
  Top 0.152: 74.94,61.59 76.21,61.59 77.48,62.87 R13.1 | 74.94,61.59 73.67,61.59 R9.1 | 74.94,61.59 74.94,74.3 76.21,74.3 77.48,73.03 78.75,73.03 U1.D18
D19  (via drill 0.33)
  Top 0.152: R2.1 82.56,62.87 81.29,64.14 81.29,73.03 U1.D19 | v1.28,26.03 1.28,22.23 5.09,18.41 5.09,1.9 R14.1
  Bottom 0.152: v1.28,26.03 1.28,37.46 3.82,40 3.82,66.68 12.71,66.68 20.33,74.3 80.02,74.3 81.29,73.03 U1.D19
D20  (1 unrouted)
D_BUSY  (via drill 0.33)
  Top 0.152: v48.27,64.14 45.73,66.68 R56.1 | v64.78,56.51 64.78,36.2 TFT01-3.2.24
  Bottom 0.152: v48.27,64.14 50.81,66.68 55.89,66.68 57.16,65.41 58.43,65.41 59.7,64.14 59.7,62.87 53.35,62.87 52.08,61.59 52.08,56.51 v64.78,56.51
D_CLK  (via drill 0.33)
  Top 0.152: v50.81,64.14 48.27,66.68 R55.1 | v55.89,65.41 58.43,62.87 58.43,51.43 59.7,50.16 59.7,38.73 57.16,36.2 TFT01-3.2.18
  Bottom 0.152: v50.81,64.14 52.08,65.41 v55.89,65.41
D_CS  (via drill 0.33)
  Top 0.152: v52.08,64.14 52.08,65.41 50.81,66.68 R54.1 | v58.43,64.14 59.7,62.87 59.7,51.43 60.97,50.16 60.97,37.46 59.7,36.2 TFT01-3.2.20
  Bottom 0.152: v58.43,64.14 v52.08,64.14
D_DIN  (via drill 0.33)
  Top 0.152: v53.35,61.59 53.35,66.68 R53.1 | v60.97,59.05 62.24,57.79 62.24,36.2 TFT01-3.2.22
  Bottom 0.152: v53.35,61.59 55.89,59.05 v60.97,59.05
D_IRQ  (via drill 0.33)
  Top 0.152: v62.24,62.87 58.43,66.68 R51.1 | v66.05,60.32 69.86,56.51 69.86,36.2 TFT01-3.2.28
  Bottom 0.152: v62.24,62.87 64.78,60.32 v66.05,60.32
D_OUT  (via drill 0.33)
  Top 0.152: v62.24,61.59 57.16,66.68 55.89,66.68 R52.1 | v66.05,59.05 68.59,56.51 68.59,37.46 67.32,36.2 TFT01-3.2.26
  Bottom 0.152: v62.24,61.59 64.78,59.05 v66.05,59.05
DB0  (1 unrouted)
DB1  (1 unrouted)
DB2  (1 unrouted)
DB3  (via drill 0.33)
  Top 0.152: v86.37,53.97 85.1,52.7 v85.1,45.09
  Bottom 0.152: v86.37,53.97 87.64,53.97 R38.1 | v85.1,45.09 82.56,42.54 73.67,42.54 71.13,40 48.27,40 44.46,36.2 TFT01-3.2.8
DB4  (via drill 0.33)
  Top 0.152: v82.56,52.7 82.56,55.24 R37.1 | v77.48,50.16 77.48,46.35 v76.21,45.09 | v57.16,42.54 52.08,42.54 52.08,41.27 47,36.2 TFT01-3.2.10
  Bottom 0.152: v82.56,52.7 80.02,50.16 v77.48,50.16 | v76.21,45.09 73.67,45.09 71.13,42.54 v57.16,42.54
DB5  (via drill 0.33)
  Top 0.152: v57.16,47.62 58.43,46.35 58.43,42.54 54.62,38.73 50.81,38.73 50.81,37.46 49.54,36.2 TFT01-3.2.12
  Bottom 0.152: v57.16,47.62 55.89,47.62 55.89,48.89 57.16,50.16 71.13,50.16 72.4,51.43 80.02,51.43 82.56,53.97 82.56,55.24 R36.1
DB6  (via drill 0.33)
  Top 0.152: v78.75,55.24 78.75,57.79 87.64,57.79 R35.1 | v54.62,52.7 55.89,51.43 55.89,48.89 48.27,41.27 v48.27,38.73
  Bottom 0.152: v78.75,55.24 76.21,52.7 v54.62,52.7 | v48.27,38.73 49.54,38.73 TFT01-3.2.14 52.08,36.2
DB7  (via drill 0.33)
  Top 0.152: v72.4,59.05 73.67,57.79 73.67,43.81 74.94,42.54 v74.94,38.73
  Bottom 0.152: v72.4,59.05 86.37,59.05 87.64,57.79 R34.1 | v74.94,38.73 57.16,38.73 54.62,36.2 TFT01-3.2.16
DB8  (1 unrouted)
DB9  (1 unrouted)
DB10  (1 unrouted)
DB11  (via drill 0.33)
  Top 0.152: v83.83,62.87 83.83,64.14 86.37,66.68 R29.1 | v71.13,60.32 71.13,52.7 72.4,51.43 v72.4,50.16 | v50.81,42.54 v57.16,48.89 | v39.38,42.54 35.57,42.54 30.49,37.46 v30.49,29.84 | v36.84,27.3 49.54,27.3 54.62,32.38 59.7,32.38 59.7,33.65 TFT01-3.2.19
  Bottom 0.152: v83.83,62.87 82.56,61.59 72.4,61.59 v71.13,60.32 | v72.4,50.16 71.13,48.89 v57.16,48.89 | v39.38,42.54 v50.81,42.54 | v30.49,29.84 33.03,27.3 v36.84,27.3
DB12  (via drill 0.33)
  Top 0.152: v50.81,53.97 v57.16,60.32 | v36.84,19.69 44.46,19.69 44.46,24.77 45.73,26.03 49.54,26.03 54.62,31.11 62.24,31.11 62.24,33.65 TFT01-3.2.21
  Bottom 0.152: v57.16,60.32 58.43,60.32 62.24,64.14 86.37,64.14 R30.1 | v50.81,53.97 49.54,55.24 26.68,55.24 24.14,52.7 21.6,52.7 19.06,50.16 19.06,34.92 20.33,34.92 25.41,29.84 25.41,22.23 27.95,22.23 30.49,19.69 v36.84,19.69
DB13  (via drill 0.33)
  Top 0.152: v82.56,69.22 82.56,67.95 87.64,67.95 87.64,65.41 86.37,64.14 R31.1 | v11.44,43.81 v8.9,43.81 | v12.71,33.65 11.44,32.38 11.44,23.49 15.25,19.69 17.79,19.69 17.79,18.41 16.52,17.14 16.52,13.33 v21.6,8.26 | v45.73,15.87 48.27,18.41 48.27,23.49 54.62,29.84 64.78,29.84 64.78,33.65 TFT01-3.2.23
  Bottom 0.152: v82.56,69.22 48.27,69.22 43.19,64.14 22.87,64.14 8.9,50.16 v8.9,43.81 | v11.44,43.81 11.44,33.65 v12.71,33.65 | v21.6,8.26 29.22,8.26 30.49,6.98 34.3,6.98 39.38,12.06 41.92,12.06 v45.73,15.87
DB14  (via drill 0.33)
  Top 0.152: v60.97,65.41 63.51,62.87 v63.51,45.09 | v49.54,45.09 35.57,45.09 35.57,43.81 33.03,41.27 29.22,41.27 29.22,38.73 26.68,36.2 v26.68,29.84 | v52.08,22.23 54.62,22.23 54.62,24.77 57.16,27.3 69.86,27.3 v69.86,31.11
  Bottom 0.152: v60.97,65.41 80.02,65.41 82.56,67.95 87.64,67.95 87.64,62.87 86.37,61.59 R32.1 | v49.54,45.09 v63.51,45.09 | v26.68,29.84 26.68,24.77 29.22,24.77 31.76,22.23 v52.08,22.23 | TFT01-3.2.25 v69.86,31.11
DB15  (via drill 0.33)
  Top 0.152: v83.83,61.59 86.37,61.59 R33.1 | v57.16,57.79 53.35,53.97 53.35,50.16 50.81,47.62 31.76,47.62 v31.76,45.09 | v31.76,40 27.95,36.2 27.95,29.84 26.68,28.57 26.68,26.03 27.95,24.77 v27.95,23.49 | v49.54,20.95 52.08,23.49 52.08,24.77 55.89,28.57 68.59,28.57 68.59,32.38 69.86,33.65 TFT01-3.2.27
  Bottom 0.152: v83.83,61.59 82.56,60.32 72.4,60.32 69.86,57.79 v57.16,57.79 | v31.76,40 v31.76,45.09 | v27.95,23.49 30.49,20.95 v49.54,20.95
F_HOLD  (via drill 0.33)
  Top 0.152: v67.32,41.27 67.32,56.51 64.78,59.05 64.78,60.32 67.32,62.87 67.32,66.68 63.51,66.68 R49.1 | v80.02,43.81 83.83,40 83.83,37.46 TFT01-3.2.40 85.1,36.2
  Bottom 0.152: v67.32,41.27 71.13,41.27 73.67,43.81 v80.02,43.81
F_WP  (via drill 0.33)
  Top 0.152: v64.78,62.87 60.97,66.68 R50.1 | v71.13,61.59 74.94,57.79 74.94,47.62 v76.21,46.35 | v77.48,45.09 82.56,40 82.56,36.2 TFT01-3.2.38
  Bottom 0.152: v64.78,62.87 66.05,61.59 v71.13,61.59 | v77.48,45.09 v76.21,46.35
GND  (8 unrouted)
  pour Top: 99.83,75.56 0.01,75.56 0.01,0.13 99.83,-0.13
LED
  Top 0.152: R12.2 29.22,67.95 U1.D13 29.22,73.03
N$1
  Top 0.152: LED3.C 78.75,18.41 76.21,15.87 Q2.D 76.21,9.53 78.75,6.98 12VOUT.2
N$2  (via drill 0.33)
  Top 0.152: v88.91,27.3 88.91,31.11 90.18,32.38 90.18,42.54 88.91,43.81 R21.1 | v93.99,27.3 95.26,28.57 95.26,45.09 96.53,46.35 96.53,47.62 U1.D41
  Bottom 0.152: v93.99,27.3 v88.91,27.3
N$3
  Top 1.016: !!!SCHEMATICDOESNOTREFLECTDESIGN.2 47,6.98 50.81,3.17 59.7,3.17 59.7,6.98 12V.2
N$4
  Top 0.152: R16.1 19.06,43.81 21.6,43.81 21.6,42.54 22.87,41.27 R4.A
N$5  (via drill 0.33)
  Top 0.152: v30.49,61.59 34.3,57.79 R17.2 | v19.06,53.97 20.33,52.7 20.33,46.35 v21.6,45.09
  Bottom 0.152: v30.49,61.59 26.68,57.79 21.6,57.79 19.06,55.24 v19.06,53.97 | v21.6,45.09 25.41,41.27 27.95,41.27 R4.E
N$6  (via drill 0.33)
  Top 0.152: v24.14,47.62 24.14,42.54 25.41,41.27 25.41,31.11 R1.S | v27.95,51.43 v27.95,56.51 27.95,57.79 24.14,61.59 2.048V.1
  Bottom 0.152: v27.95,51.43 v24.14,47.62 | v27.95,56.51 26.68,56.51 24.14,53.97 22.87,53.97 IC4.6
N$7
  Top 0.152: 87.64,14.6 87.64,15.87 91.45,19.69 LED4.C | 87.64,14.6 87.64,8.26 88.91,6.98 12VOUT.4 | 87.64,14.6 Q1.D
N$8
  Top 0.152: R11.1 25.41,12.06 22.87,14.6 22.87,18.41 R3.A
N$9  (via drill 0.33)
  Top 0.152: v26.68,19.69 22.87,19.69 19.06,15.87 R15.2
  Bottom 0.152: v26.68,19.69 27.95,18.41 R3.E
N$10
  Top 0.152: R4.S 25.41,43.81 25.41,56.51 21.6,60.32 19.06,60.32 19.06,65.41 2.5VY.1 16.52,69.22 13.98,69.22 IC6.5
N$11
  Top 0.152: R3.S 25.41,20.95 22.87,23.49 22.87,27.3 17.79,32.38 2.5V.1 16.52,32.38 16.52,34.92 12.71,34.92 IC5.5
N$12
  Top 0.152: 7.63,38.73 10.17,38.73 U$1.2 | 7.63,38.73 3.82,42.54 1.28,42.54 GALVOX.2 | 7.63,38.73 U$1.1
N$13
  Top 0.152: 7.63,46.35 10.17,46.35 U$1.7 | 7.63,46.35 1.28,46.35 1.28,45.09 GALVOX.1 | 7.63,46.35 U$1.8
N$14
  Top 0.152: 7.63,34.92 7.63,32.38 2.55,32.38 R5.2 | 7.63,34.92 10.17,34.92 IC5.6 | 7.63,34.92 IC5.7
N$15
  Top 0.152: 7.63,29.84 2.55,29.84 R5.1 | 7.63,29.84 IC5.2 7.63,27.3 | 7.63,29.84 11.44,33.65 11.44,36.2 15.25,36.2 16.52,37.46 19.06,37.46 R18.2
N$16
  Top 0.152: R7.2 19.06,55.24 22.87,51.43 IC4.7
N$17  (via drill 0.33)
  Top 0.152: 5.09,23.49 10.17,23.49 IC5.3 | v20.33,55.24 20.33,56.51 19.06,57.79 R7.1 | v5.09,40 1.28,36.2 1.28,27.3 5.09,23.49 | 5.09,23.49 R26.2
  Bottom 0.152: v20.33,55.24 20.33,52.7 19.06,52.7 6.36,40 v5.09,40
N$18
  Top 0.152: 8.9,69.22 8.9,66.68 2.55,66.68 R6.2 | 8.9,69.22 11.44,69.22 IC6.6 | 8.9,69.22 IC6.7
N$19
  Bottom 0.152: R22.2 88.91,69.22 90.18,70.48 93.99,70.48 U1.D22
N$20  (via drill 0.33)
  Top 0.152: R6.1 2.55,64.14 8.9,64.14 8.9,61.59 IC6.2 | v16.52,60.32 17.79,59.05 17.79,52.7 19.06,51.43 R19.2
  Bottom 0.152: v16.52,60.32 15.25,59.05 11.44,59.05 8.9,61.59 IC6.2
N$21
  Top 0.152: R8.2 20.33,61.59 22.87,64.14 29.22,64.14 29.22,57.79 30.49,56.51 IC4.4
N$22  (via drill 0.33)
  Top 0.152: 17.79,61.59 13.98,65.41 11.44,65.41 11.44,61.59 IC6.3 | v22.87,60.32 26.68,56.51 26.68,43.81 33.03,43.81 R23.2 | v21.6,59.05 19.06,59.05 17.79,60.32 17.79,61.59 | 17.79,61.59 R8.1
  Bottom 0.152: v21.6,59.05 v22.87,60.32
N$23  (via drill 0.33)
  Top 0.152: v82.56,71.76 82.56,70.48 87.64,70.48 88.91,69.22 R27.2 | v6.36,45.09 11.44,40 11.44,37.46 10.17,36.2 6.36,36.2 v6.36,34.92 | v97.8,27.3 99.07,28.57 99.07,67.95 96.53,70.48 U1.D23
  Bottom 0.152: v82.56,71.76 81.29,70.48 27.95,70.48 6.36,48.89 v6.36,45.09 | v6.36,34.92 8.9,32.38 8.9,28.57 13.98,28.57 19.06,23.49 20.33,23.49 26.68,17.14 35.57,17.14 38.11,19.69 48.27,19.69 50.81,17.14 86.37,17.14 96.53,27.3 v97.8,27.3
N$24
  Top 0.152: 7.63,50.16 10.17,50.16 U$4.2 | 7.63,50.16 3.82,53.97 1.28,53.97 GALVOY.2 | 7.63,50.16 U$4.1
N$25
  Top 0.152: 7.63,57.79 10.17,57.79 U$4.7 | 7.63,57.79 1.28,57.79 1.28,56.51 GALVOY.1 | 7.63,57.79 U$4.8
N$26
  Bottom 0.152: R28.2 88.91,66.68 90.18,67.95 93.99,67.95 U1.D24
N$27
  Top 0.152: R29.2 88.91,66.68 91.45,69.22 91.45,73.03 92.72,74.3 95.26,74.3 95.26,69.22 96.53,67.95 U1.D25
N$28
  Bottom 0.152: R30.2 88.91,64.14 90.18,65.41 93.99,65.41 U1.D26
N$29  (1 unrouted)
N$30
  Bottom 0.152: R32.2 88.91,61.59 90.18,62.87 93.99,62.87 U1.D28
N$31  (1 unrouted)
N$32
  Bottom 0.152: R34.2 90.18,57.79 92.72,60.32 93.99,60.32 U1.D30
N$33  (via drill 0.33)
  Top 0.152: v92.72,73.03 92.72,60.32 90.18,57.79 R35.2
  Bottom 0.152: v92.72,73.03 93.99,74.3 97.8,74.3 99.07,73.03 99.07,60.32 96.53,60.32 U1.D31
N$34  (via drill 0.33)
  Top 0.152: v83.83,53.97 85.1,53.97 87.64,56.51 93.99,56.51 93.99,57.79 U1.D32
  Bottom 0.152: v83.83,53.97 83.83,55.24 R36.2
N$35  (1 unrouted)
N$36
  Bottom 0.152: R38.2 90.18,53.97 91.45,55.24 93.99,55.24 U1.D34
N$37  (1 unrouted)
N$38  (1 unrouted)
N$39  (1 unrouted)
N$40  (1 unrouted)
  Top 0.152: R10.1 69.86,61.59 68.59,61.59 68.59,66.68 67.32,67.95 44.46,67.95 44.46,66.68 48.27,62.87 48.27,60.32 JP6.1
N$41  (1 unrouted)
N$42  (1 unrouted)
N$43  (1 unrouted)
N$44  (1 unrouted)
N$45
  Top 0.152: LED3.A 78.75,20.95 71.13,20.95 R24.2
N$46
  Top 0.152: LED1.A 24.14,67.95 26.68,67.95 R12.1
N$47  (via drill 0.33)
  Top 0.152: v3.82,4.44 3.82,3.17 2.55,1.9 R14.2
  Bottom 0.152: v3.82,4.44 6.36,6.98 29.22,6.98 30.49,5.71 34.3,5.71 39.38,10.79 68.59,10.79 72.4,14.6 Q2.G
N$48  (1 unrouted)
N$49  (via drill 0.33)
  Top 0.152: v91.45,52.7 90.18,53.97 R39.2 | v92.72,51.43 92.72,34.92 v91.45,33.65 | v83.83,31.11 83.83,26.03 85.1,24.77 85.1,23.49 86.37,22.23 v92.72,22.23 | v93.99,23.49 93.99,24.77 97.8,28.57 97.8,53.97 96.53,55.24 U1.D35
  Bottom 0.152: v92.72,51.43 v91.45,52.7 | v91.45,33.65 87.64,33.65 85.1,31.11 v83.83,31.11 | v93.99,23.49 v92.72,22.23
N$50
  Top 0.152: 90.18,19.69 LED4.A 86.37,19.69 R25.2
N$51  (via drill 0.33)
  Top 0.152: v91.45,48.89 91.45,51.43 92.72,52.7 93.99,52.7 U1.D36
  Bottom 0.152: v91.45,48.89 88.91,48.89 R40.2
N$52  (via drill 0.33)
  Top 0.152: v91.45,34.92 91.45,46.35 88.91,48.89 R41.2 | v87.64,36.2 87.64,32.38 86.37,31.11 v86.37,27.3 | v95.26,46.35 95.26,51.43 96.53,52.7 U1.D37
  Bottom 0.152: v91.45,34.92 90.18,36.2 v87.64,36.2 | v86.37,27.3 87.64,26.03 93.99,26.03 95.26,27.3 v95.26,46.35
N$53
  Bottom 0.152: R42.2 83.83,47.62 83.83,51.43 91.45,51.43 92.72,50.16 93.99,50.16 U1.D38
N$54  (via drill 0.33)
  Top 0.152: v88.91,32.38 88.91,37.46 83.83,42.54 83.83,47.62 R43.2 | v91.45,31.11 92.72,29.84 92.72,23.49 95.26,20.95 99.07,20.95 v99.07,27.3
  Bottom 0.152: v88.91,32.38 90.18,31.11 v91.45,31.11 | v99.07,27.3 99.07,50.16 96.53,50.16 U1.D39
N$55
  Bottom 0.152: R44.2 88.91,43.81 88.91,46.35 92.72,46.35 93.99,47.62 U1.D40
N$56
  Top 0.152: R45.1 90.18,29.84 90.18,31.11 93.99,34.92 U1.D50
N$60
  Top 0.152: R49.2 63.51,69.22 63.51,73.03 U1.RX
N$61
  Top 0.152: R50.2 60.97,69.22 60.97,73.03 U1.TX
N$62
  Top 0.152: R51.2 58.43,69.22 58.43,73.03 U1.D2
N$63
  Top 0.152: R52.2 55.89,69.22 55.89,73.03 U1.D3
N$64
  Top 0.152: R53.2 53.35,69.22 53.35,73.03 U1.D4
N$65
  Top 0.152: R54.2 50.81,69.22 50.81,73.03 U1.D5
N$66
  Top 0.152: R55.2 48.27,69.22 48.27,73.03 U1.D6
N$67
  Top 0.152: R56.2 45.73,69.22 45.73,73.03 U1.D7
N$86  (via drill 0.33)
  Top 0.152: v36.84,14.6 38.11,14.6 39.38,13.33 v44.46,13.33 | v47,15.87 49.54,18.41 49.54,19.69 50.81,20.95 62.24,20.95 63.51,22.23 72.4,22.23 72.4,26.03 v77.48,31.11
  Bottom 0.152: v36.84,14.6 6.36,14.6 R60.S | v47,15.87 v44.46,13.33 | v77.48,31.11 78.75,32.38 81.29,32.38 82.56,33.65 TFT01-3.2.37
NEG_6V  (via drill 0.33)
  Top 0.152: 15.25,46.35 13.98,47.62 13.98,61.59 IC6.4 | 16.52,27.3 12.71,27.3 IC5.4 | v11.44,15.87 v11.44,5.71 | 16.52,27.3 16.52,22.23 C5.1 | 16.52,27.3 C4.1 | 15.25,46.35 17.79,43.81 17.79,42.54 19.06,41.27 21.6,41.27 v21.6,31.11 | 15.25,46.35 U$1.5
  Bottom 0.152: v11.44,5.71 15.25,1.9 38.11,1.9 45.73,9.53 !!!SCHEMATICDOESNOTREFLECTDESIGN.3 | v11.44,15.87 16.52,20.95 C5.1 | v21.6,31.11 20.33,29.84 19.06,29.84 C4.1 16.52,27.3
POS_5V  (via drill 0.33)
  Top 0.152: v27.95,50.16 31.76,50.16 33.03,51.43 33.03,53.97 36.84,57.79 R17.1 | C1.1 66.05,14.6 | 19.06,13.33 17.79,14.6 17.79,17.14 21.6,20.95 v21.6,27.3 | 66.05,14.6 66.05,13.33 63.51,10.79 58.43,10.79 58.43,6.98 55.89,4.44 50.81,4.44 50.81,6.98 47,10.79 38.11,10.79 34.3,6.98 24.14,6.98 24.14,12.06 22.87,13.33 19.06,13.33 | 66.05,14.6 IC2.3 | 19.06,13.33 R15.1 | 22.87,48.89 IC4.8 22.87,42.54 24.14,41.27 24.14,29.84 22.87,28.57 R1.A
  Bottom 0.152: v27.95,50.16 24.14,46.35 22.87,47.62 IC4.8 22.87,48.89 | v21.6,27.3 22.87,28.57 R1.A
POS_6V  (via drill 0.33)
  Top 0.152: IC7.3 54.62,19.69 C3.1 | v48.27,12.06 38.11,12.06 34.3,8.26 C7.1 | 12.71,46.35 11.44,47.62 11.44,56.51 12.71,57.79 | v10.17,42.54 12.71,42.54 12.71,46.35 | 12.71,46.35 U$1.6 | 12.71,57.79 12.71,60.32 5.09,60.32 1.28,64.14 1.28,69.22 6.36,69.22 IC6.8 | 12.71,57.79 U$4.6
  Bottom 0.152: v48.27,12.06 53.35,12.06 54.62,13.33 IC7.3 | 5.09,34.92 10.17,40 v10.17,42.54 | 5.09,34.92 3.82,33.65 2.55,33.65 2.55,26.03 1.28,24.77 1.28,12.06 5.09,8.26 15.25,8.26 16.52,9.53 26.68,9.53 27.95,10.79 34.3,10.79 34.3,8.26 C7.1 | 5.09,34.92 IC5.8
POS_12V
  Top 1.016: IC2.1 60.97,14.6 55.89,9.53 55.89,8.26 12V.1 54.62,8.26 49.54,13.33 IC7.1 49.54,14.6 44.46,14.6 44.46,15.87 40.65,15.87 F1.2
RESET  (via drill 0.33)
  Top 0.152: v30.49,26.03 29.22,24.77 29.22,13.33 v26.68,10.79 | v15.25,9.53 12.71,6.98 12.71,3.17 13.98,1.9 S1.2
  Bottom 0.152: v30.49,26.03 31.76,26.03 33.03,24.77 U1.RES | v26.68,10.79 16.52,10.79 v15.25,9.53
RS  (via drill 0.33)
  Top 0.152: v58.43,47.62 58.43,50.16 v54.62,53.97
  Bottom 0.152: v58.43,47.62 71.13,47.62 72.4,48.89 81.29,48.89 82.56,47.62 R42.1 | v54.62,53.97 53.35,52.7 26.68,52.7 24.14,50.16 21.6,50.16 20.33,48.89 20.33,38.73 26.68,38.73 34.3,31.11 40.65,31.11 43.19,33.65 44.46,33.65 TFT01-3.2.7
RST  (via drill 0.33)
  Top 0.152: v87.64,40 87.64,43.81 R21.2
  Bottom 0.152: v87.64,40 92.72,34.92 92.72,31.11 91.45,29.84 77.48,29.84 76.21,31.11 76.21,33.65 77.48,33.65 TFT01-3.2.33
SD_CS  (via drill 0.33)  (1 unrouted)
  Top 0.152: v33.03,36.2 33.03,29.84 34.3,28.57 34.3,13.33 33.03,12.06 R59.2 | v54.62,50.16 v52.08,47.62 | v71.13,51.43 71.13,45.09 73.67,42.54 v73.67,41.27
  Bottom 0.152: v33.03,36.2 30.49,38.73 30.49,41.27 29.22,42.54 29.22,46.35 36.84,46.35 38.11,47.62 v52.08,47.62 | v54.62,50.16 55.89,50.16 57.16,51.43 v71.13,51.43 | v73.67,41.27 76.21,38.73 77.48,38.73 TFT01-3.2.36 80.02,36.2
SD_DIN  (1 unrouted)
SD_IN  (1 unrouted)
SD_OUT  (via drill 0.33)
  Top 0.152: v86.37,26.03 87.64,27.3 87.64,29.84 R45.2 | v34.3,29.84 34.3,36.2 41.92,43.81 v47,43.81 | v71.13,43.81 71.13,37.46 TFT01-3.2.30 72.4,36.2
  Bottom 0.152: v86.37,26.03 83.83,28.57 72.4,28.57 71.13,29.84 v34.3,29.84 | v71.13,43.81 v47,43.81
SD_SCK  (via drill 0.33)
  Top 0.152: v80.02,41.27 74.94,36.2 TFT01-3.2.32 | v86.37,38.73 86.37,32.38 85.1,31.11 | v85.1,28.57 85.1,31.11 | v31.76,29.84 31.76,20.95 R57.2 | v26.68,42.54 v26.68,37.46 | 85.1,31.11 83.83,32.38 73.67,32.38 73.67,29.84 69.86,26.03 v57.16,26.03
  Bottom 0.152: v80.02,41.27 81.29,40 85.1,40 v86.37,38.73 | v85.1,28.57 91.45,28.57 93.99,31.11 93.99,32.38 U1.D52 | v31.76,29.84 30.49,31.11 29.22,31.11 | 29.22,31.11 26.68,33.65 v26.68,37.46 | v26.68,42.54 26.68,47.62 30.49,51.43 IC4.2 | v57.16,26.03 33.03,26.03 29.22,29.84 29.22,31.11
VCC
  Top 0.152: R20.1 49.54,53.97 48.27,55.24 48.27,57.79 JP6.2
  pour Bottom: 99.83,75.56 0.01,75.56 0.01,0.13 99.83,-0.13
WR  (via drill 0.33)
  Top 0.152: v80.02,46.35 80.02,47.62 82.56,47.62 R43.1 | v52.08,46.35 44.46,38.73 v38.11,38.73 | v35.57,32.38 43.19,32.38 45.73,29.84 47,29.84 47,33.65 TFT01-3.2.9
  Bottom 0.152: v80.02,46.35 78.75,47.62 72.4,47.62 71.13,46.35 v52.08,46.35 | v38.11,38.73 36.84,38.73 34.3,36.2 34.3,32.38 v35.57,32.38
X_IN  (via drill 0.33)
  Top 0.152: 19.06,40 15.25,40 15.25,38.73 U$1.4 | v10.17,29.84 8.9,28.57 8.9,24.77 7.63,24.77 5.09,27.3 IC5.1 | v16.52,36.2 20.33,36.2 20.33,38.73 19.06,40 | 19.06,40 R18.1
  Bottom 0.152: v16.52,36.2 v10.17,29.84
Y_IN  (via drill 0.33)
  Top 0.152: 16.52,50.16 15.25,50.16 U$4.4 | 16.52,50.16 19.06,50.16 R19.1 | v12.71,64.14 15.25,61.59 15.25,60.32 16.52,59.05 16.52,50.16
  Bottom 0.152: v12.71,64.14 6.36,64.14 6.36,61.59 IC6.1
Z-DIR  (1 unrouted)
Z-EN  (via drill 0.33)  (1 unrouted)
  Top 0.152: v52.08,53.97 52.08,51.43 49.54,51.43 47,53.97 R20.2 | v76.21,55.24 78.75,52.7 78.75,46.35 85.1,40 v85.1,38.73 | v82.56,31.11 78.75,31.11 73.67,26.03 73.67,24.77 U1.A8
  Bottom 0.152: v52.08,53.97 53.35,55.24 v76.21,55.24 | v85.1,38.73 86.37,37.46 86.37,33.65 85.1,32.38 83.83,32.38 v82.56,31.11
Z-MAX
  Top 0.152: U1.D17 76.21,73.03 76.21,67.95 ZMAX.1
Z-MIN
  Top 0.152: U1.D16 73.67,73.03 72.4,71.76 72.4,67.95 ZMIN.1
Z-STEP  (1 unrouted)
(copper drawn outside any net)
  shapes: Bottom circle x1

### Text on the board
Document: LAMPS 0.1 (Laser Arduino MEGA Pololu Shield)